# Altium schematic sheet Pulse flashlight.SchDoc
size A4; SheetNumber: 1; SheetTotal: 1
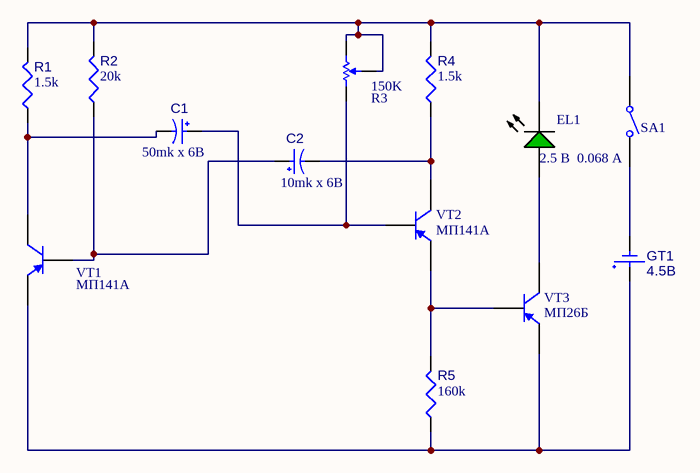
[diagram p0: Pulse flashlight.SchDoc]

## Parts
C1  value 50mk x 6B  [VISH-7343-31_N]  (hidden comment: 293D107X9010D2TE3)
C2  value 10mk x 6B  [VISH-7343-31_N]  (hidden comment: 293D107X9010D2TE3)
EL1  2.5 B  0.068 A  [AVAG-HSMX-C190_V]
GT1  4.5B  [SEIK-MS621FE-FL11E-2_V]
R1  value 1.5k  [RESC0805(2012)_L]  (hidden comment: 1KR5J)
R2  value 20k  [RESC0805(2012)_L]  (hidden comment: 1KR5J)
R3  value 150K  [BOUR-TC33X-2_V]  (hidden comment: TC33X-2-103E)
R4  value 1.5k  [RESC0805(2012)_L]  (hidden comment: 1KR5J)
R5  value 160k  [RESC0805(2012)_L]  (hidden comment: 1KR5J)
SA1  B3U-3000P  [OMRON-B3U-3000P_V]  (value not drawn)
VT1  МП141А  [ONSC-SOT-23-3-318-08_V]
VT2  МП141А  [UNIC-TO-92-3]
VT3  МП26Б  [UNIC-TO-92-3]

## Nets
NetC1_1: C1.1 R3.1 VT2.2(B)
NetC1_2: C1.2 R1.1 VT1.3(C)
NetC2_1: C2.1 R2.1 VT1.1(B)
NetC2_2: C2.2 R4.1 VT2.3(C)
NetEL1_1: EL1.1(A) VT3.3(C)
NetEL1_2: EL1.2(K) R1.2 R2.2 R3.2 R3.3 R4.2 SA1.1
NetGT1_1: GT1.1(+) R5.1 VT1.2(E) VT3.1(E)
NetGT1_2: GT1.2(-) SA1.2
NetR5_2: R5.2 VT2.1(E) VT3.2(B)

## Library data of the parts
C1 C2 = CMP-001-00020-7: Solid Tantalum Chip Capacitor, 100 uF, +/- 10%, 10 V, -55 to 125 degC, 2917 (7343 Metric), RoHS, Tape and Reel; Manufacturer: Vishay Semiconductor; Voltage Rating: 10V; Packaging: TapeandReel; Mounting Technology: SM; Manufacturer URL: http://www.vishay.com/; Datasheet Version: Aug-16; Min Operating Temperature: -55°C; RoHS Compliant: Unknown; Tolerance: 10%; Package Description: 2-Pin Surface Mount Device, Body 7.3 x 4.3 mm; Datasheet URL: http://www.vishay.com/docs/40002/293d.pdf; Case/Package: 7343-31; Max Operating Temperature: 125°C; Package Reference: 7343-31; Capacitor Type: Tantalum
EL1 = CMP-007-00013-2: LED Uni-Color Green, 52 mW, 20 mA, -40 to 85 degC, 2-Pin SMD, RoHS, Tape and Reel; Manufacturer: Avago; Forward Current: 20mA; Viewing Angle: 170degrees; Luminous Intensity: 15mcd; Lens Style: Diffused; Forward Voltage: 2.2V; Power: 52mW; Mounting Technology: SM; RoHS Compliant: True; Packaging: TapeandReel; Illumination Colour: Green; Datasheet URL: http://docs.avagotech.com/docs/AV02-0551EN; Min Operating Temperature: -40°C; Max Operating Temperature: 85°C; Pins: 2; Package Description: 2-Pin Surface Mount Device, Body 1.6 x 0.8 mm, Height 0.9 mm; Nominal Vf: 2.2V; Case/Package: 0603; Manufacturer URL: http://www.avagotech.com/; Datasheet Version: Mar-12; Colour: Green; Package Reference: HSMX-C190; Package Quantity: 4000
GT1 = CMP-00029-00000-1: MS Lihium Rechargeable Battery, 3 V, -20 to 60 degC, Tray; RoHS Compliant: NotApplicable; Mounting Technology: WithLeads; Pins: 2
R1 R2 R4 R5 = CMP-009-00076-2: 1K 0.125W 5% 0805 (2012 Metric)  SMD; Power: 125mW; Pins: 2; Mounting Technology: SMT; Tolerance: 5%; Case/Package: 0805
R3 = CMP-009-00060-2: Trimming Potentiometer, 10000 Ohm, -40 to 100 degC, 3-Pin SMD, RoHS, Tape and Reel; Manufacturer: Bourns; Tolerance: 25%; Power: 100mW; Resistance: 1k; Max Operating Temperature: 120°C; Package Description: 3-Pin Surface Mount Device, Body 3.8 x 3.6 mm; Datasheet Version: Aug-16; RoHS Compliant: True; Mounting Technology: SM; Package Quantity: 2500; Manufacturer URL: http://www.bourns.com/; Datasheet URL: http://www.bourns.com/docs/Product-Datasheets/TC33.pdf; Case/Package: TC33X-2; Package Reference: TC33X-2; Composition: Potentiometer; Packaging: TapeandReel; Min Operating Temperature: -40°C
SA1 = CMP-011-00005-2: Tactile Switch, SPST-NO, 0.05 A, 12 V, -25 to 70 degC, 2-Pin SMD, RoHS, Tape and Reel; Manufacturer: Omron Electronic Components; Operating Force: 162gf; Voltage Rating (DC): 12V; Current Rating: 50mA; IP Rating: IP40; Throw Configuration: SPST; Max Contact Resistance: 100mohm; RoHS Compliant: True; Contact Current Rating: 50mA; Manufacturer URL: http://www.omron.com/; Packaging: TapeandReel; Max Voltage Rating (DC): 12V; Contact Material: Silver; Datasheet Version: Jan-15; Package Reference: B3U-3000P; Package Description: 2-Pin Surface Mount Device, Body 4 x 3.2 mm; Min Operating Temperature: -25°C; Package Quantity: 4000; Max Operating Temperature: 70°C; Max Current Rating: 50mA; Voltage Rating: 12V; Case/Package: B3U-3000P; Mounting Technology: SM; Datasheet URL: https://www.omron.com/ecb/products/pdf/en-b3u.pdf
VT1 = CMP-013-00003-3: PNP General-Purpose Amplifier, 40 V, 0.2 A, -55 to 150 degC, 3-Pin SOT23, RoHS, Tape and Reel; Manufacturer: ON Semiconductor; Power: 225mW; Frequency: 250MHz; hFE Min: 80; Vce Max: 400mV; Elements: 1; Packaging: TapeandReel; Max Operating Temperature: 150°C; Datasheet URL: http://www.onsemi.cn/pub_link/Collateral/MMBT3906LT1-D.PDF; Pins: 3; Package Quantity: 3000; Package Description: 3-Pin Small Outline Transistor, Body 2.9 x 1.3 mm, Pitch 0.95 mm; Mounting Technology: SM; Datasheet Version: Rev. 12, 10/2016; Package Reference: SOT-23 (318-08); RoHS Compliant: True; Min Operating Temperature: -55°C; Case/Package: TO-236-3
VT2 VT3 = CMP-013-00004-3: Low Voltage High Current Small Signal PNP Transistor, 20 V, 700 mA, 3-Pin TO-92, RoHS; Manufacturer: Unisonic; Mounting Technology: TH; Package Description: 3-Pin Through Hole Device, Dia 4.58 mm, Pitch 1.27 mm; Datasheet URL: http://media.nkcelectronics.com/datasheet/s8550.pdf; Case/Package: TO-92-3; Datasheet Version: Rev. E, 06/2014; Package Reference: TO-92-3; RoHS Compliant: Unknown